# EAGLE design DMSMDS (EAGLE 8.0.1)
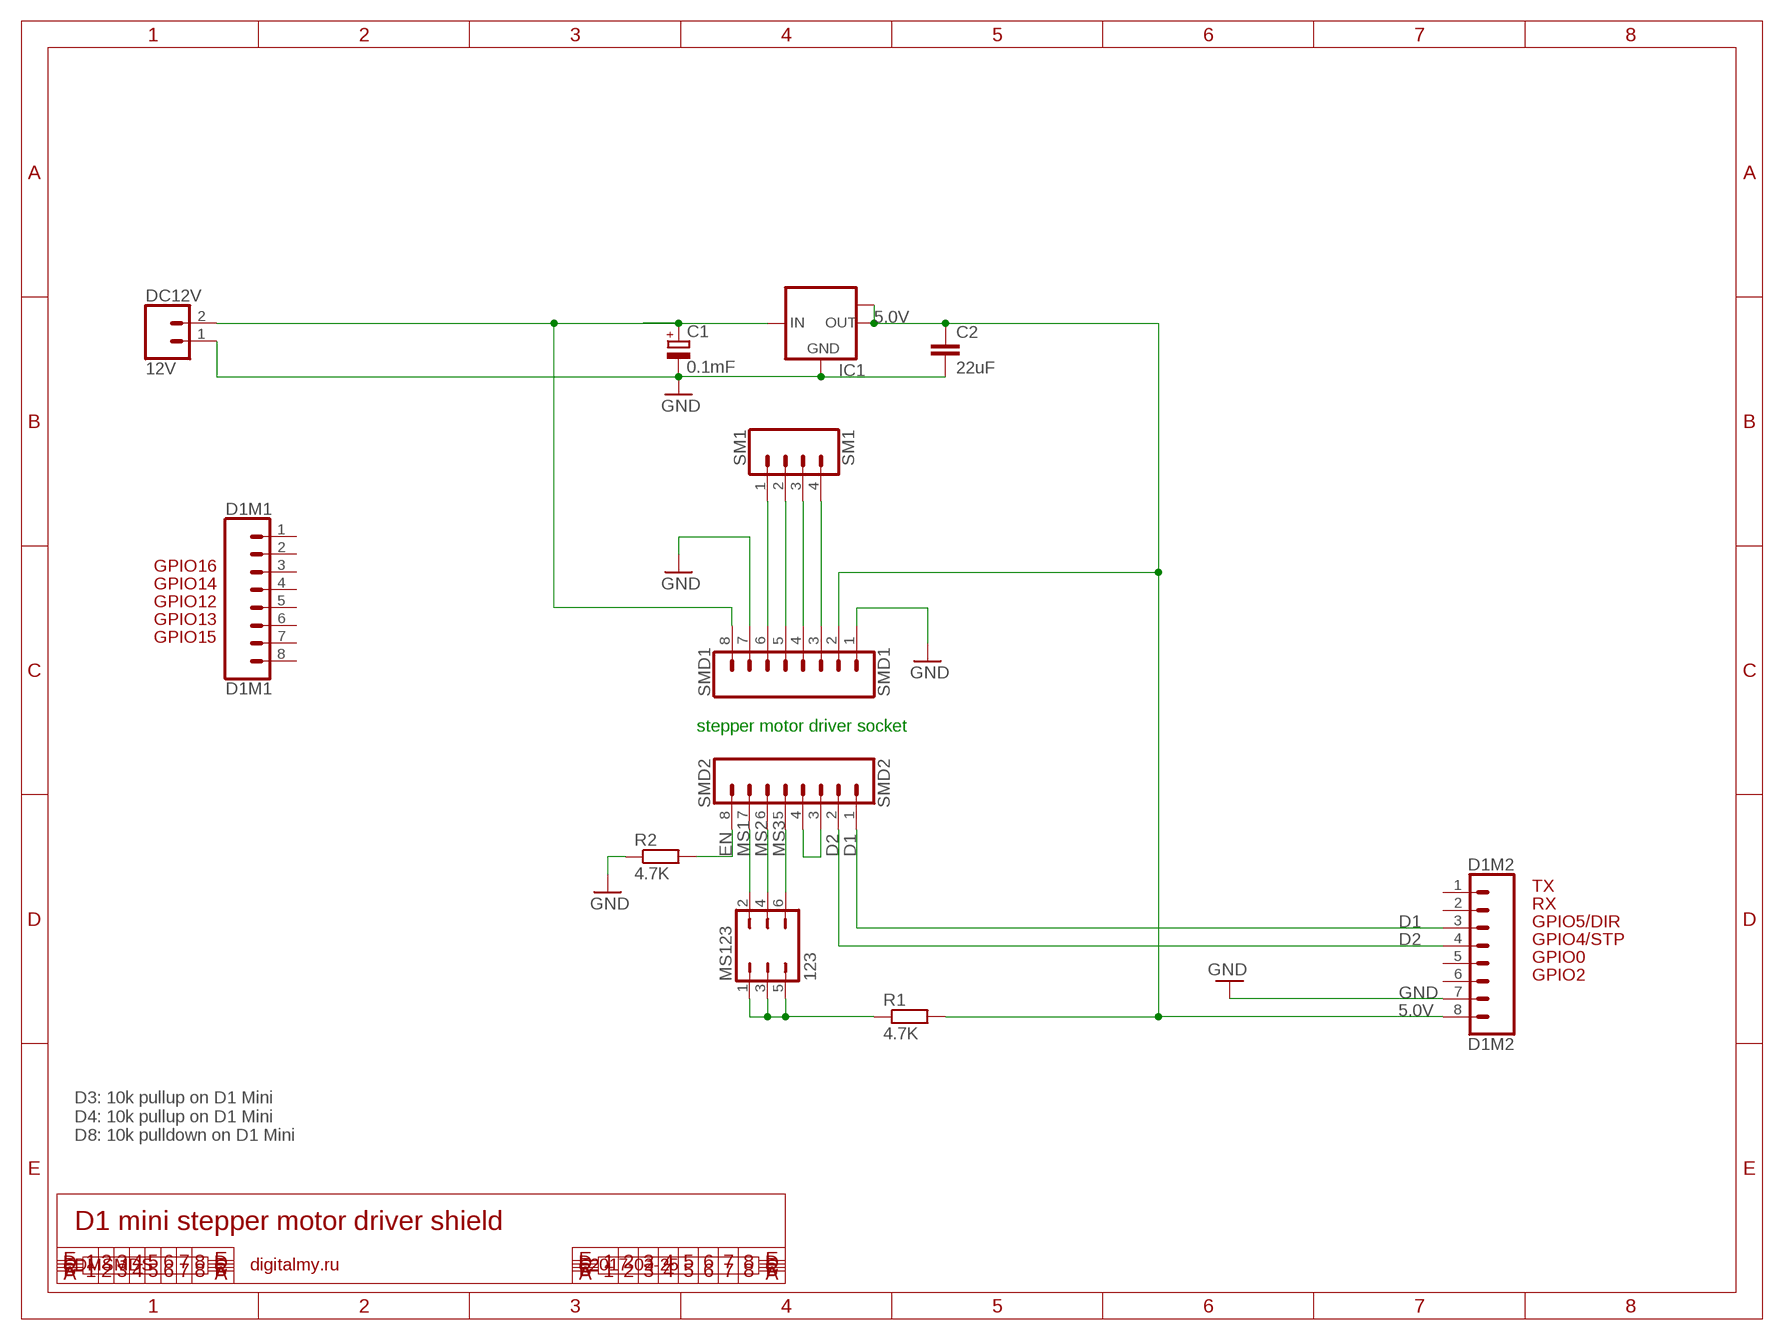
[diagram p0: schematic, sheet 1]

## Parts
C1  0.1mF  CPOL-EUE5-8.5  [E5-8,5]
C2  22uF  C-EUC1206  [C1206]
D1M1  D1M1  CONN_08"  [1X08]
D1M2  D1M2  CONN_08"  [1X08]
DC12V  12V  CONN_02  [1X02]
IC1  LM1117MPX-5.0  [SOT223]
MS123  123  JP3Q  [JP3Q]
R1  4.7K  R-EU_R0402  [R0402]
R2  4.7K  R-EU_R0402  [R0402]
SM1  SM1  CONN_04  [1X04]
SMD1  SMD1  CONN_08NO_SILK_FEMALE_PTH  [1X08_NO_SILK]
SMD2  SMD2  CONN_08NO_SILK_FEMALE_PTH  [1X08_NO_SILK]

## Nets
5.0V [power]: C2.1 D1M2.8 IC1.2(OUT) IC1.TAB(OUT1) R1.2 SMD1.2
12V: C1.+ DC12V.2 IC1.3(IN) SMD1.8
D1: D1M2.3 SMD2.1
D2: D1M2.4 SMD2.2
EN: R2.2 SMD2.8
GND [power]: C1.- C2.2 D1M2.7 DC12V.1 IC1.1(GND) R2.1 SMD1.1 SMD1.7
MS1: MS123.2 SMD2.7
MS2: MS123.4 SMD2.6
MS3: MS123.6 SMD2.5
MSP: MS123.1 MS123.3 MS123.5 R1.1
N$1: SM1.1 SMD1.6
N$2: SM1.2 SMD1.5
N$3: SM1.3 SMD1.4
N$4: SM1.4 SMD1.3
N$10: SMD2.3 SMD2.4
Unconnected: D1M1.1 D1M1.2 D1M1.3 D1M1.4 D1M1.5 D1M1.6 D1M1.7 D1M1.8 D1M2.1 D1M2.2 D1M2.5 D1M2.6

## Notes on the sheet
- GPIO16
- GPIO14
- GPIO12
- GPIO13
- GPIO15
- stepper motor driver socket
- TX
- RX
- GPIO5/DIR
- GPIO4/STP
- GPIO0
- GPIO2
- D3: 10k pullup on D1 Mini
  D4: 10k pullup on D1 Mini
  D8: 10k pulldown on D1 Mini
- D1 mini stepper motor driver shield
- DMSMDS | digitalmy.ru | 2017-02-25

## Library data of the parts
C1 = rcl:CPOL-EU: POLARIZED CAPACITOR, European symbol
C2 = resistor:C-EU: CAPACITOR, European symbol
D1M1 D1M2 SMD1 SMD2 = SparkFun-Connectors:CONN_08: Multi connection point. Often used as Generic Header-pin footprint for 0.1 inch spaced/style header connections On any of the 0.1 inch spaced packages, you can populate with these: Break Away Headers - Straight <https://www.sparkfun.com/products/116> (PRT-00116) Break Away Male Headers - Right Angle <https://www.sparkfun.com/products/553> (PRT-00553) Female Headers <https://www.sparkfun.com/products/115> (PRT-00115) Break Away Headers - Machine Pin <https://www.sparkfun.com/products/117> (PRT-00117) Break Away Female Headers - Swiss Machine Pin <https://www.sparkfun.com/products/743> (PRT-00743) Arduino Stackable Header - 8 Pin <https://www.sparkfun.com/products/9279> (PRT-09279) For SCREWTERMINALS and SPRING TERMINALS visit here: Screw Terimnals on SparkFun.com <https://www.sparkfun.com/search/results?term=Screw+Terminals> (5mm/3.5mm/2.54mm spacing) This device is also useful as a general connection point to wire up your design to another part of your project. Our various solder wires solder well into these plated through hole pads. Hook-Up Wire - Assortment (Stranded, 22 AWG) <https://www.sparkfun.com/products/11375> (PRT-11375) Hook-Up Wire - Assortment (Solid Core, 22 AWG) <https://www.sparkfun.com/products/11367> (PRT-11367) View the entire wire category on our website here <https://www.sparkfun.com/categories/141> Special notes: Molex polarized connector foot print use with SKU : PRT-08231 with associated crimp pins and housings. 1MM SMD Version SKU: PRT-10208 NOTES ON THE VARIANTS LOCK and LOCK_LONGPADS... This footprint was designed to help hold the alignment of a through-hole component (i.e. 6-pin header) while soldering it into place. You may notice that each hole has been shifted either up or down by 0.005 of an inch from it's more standard position (which is a perfectly straight line). This slight alteration caused the pins (the squares in the middle) to touch the edges of the holes. Because they are alternating, it causes a "brace" to hold the component in place. 0.005 has proven to be the perfect amount of "off-center" position when using our standard breakaway headers. Although looks a little odd when you look at the bare footprint, once you have a header in there, the alteration is very hard to notice. Also,if you push a header all the way into place, it is covered up entirely on the bottom side.; PROD_ID: CONN-08438
DC12V = SparkFun-Connectors:CONN_02: Multi connection point. Often used as Generic Header-pin footprint for 0.1 inch spaced/style header connections On any of the 0.1 inch spaced packages, you can populate with these: Break Away Headers - Straight <https://www.sparkfun.com/products/116> (PRT-00116) Break Away Male Headers - Right Angle <https://www.sparkfun.com/products/553> (PRT-00553) Female Headers <https://www.sparkfun.com/products/115> (PRT-00115) Break Away Headers - Machine Pin <https://www.sparkfun.com/products/117> (PRT-00117) Break Away Female Headers - Swiss Machine Pin <https://www.sparkfun.com/products/743> (PRT-00743) For SCREWTERMINALS and SPRING TERMINALS visit here: Screw Terimnals on SparkFun.com <https://www.sparkfun.com/search/results?term=Screw+Terminals> (5mm/3.5mm/2.54mm spacing) This device is also useful as a general connection point to wire up your design to another part of your project. Our various solder wires solder well into these plated through hole pads. Hook-Up Wire - Assortment (Stranded, 22 AWG) <https://www.sparkfun.com/products/11375> (PRT-11375) Hook-Up Wire - Assortment (Solid Core, 22 AWG) <https://www.sparkfun.com/products/11367> (PRT-11367) View the entire wire category on our website here <https://www.sparkfun.com/categories/141> Special notes: Molex polarized connector foot print use with: PRT-08233 with associated crimp pins and housings. 2.54_SCREWTERM for use with PRT-10571. 3.5mm Screw Terminal footprints for PRT-08084 5mm Screw Terminal footprints for use with PRT-08432
IC1 = lm1117:LM1117MPX-*
MS123 = jumper:JP3Q: JUMPER
R1 R2 = resistor:R-EU_: RESISTOR, European symbol
SM1 = SparkFun-Connectors:CONN_04: Multi connection point. Often used as Generic Header-pin footprint for 0.1 inch spaced/style header connections On any of the 0.1 inch spaced packages, you can populate with these: Break Away Headers - Straight <https://www.sparkfun.com/products/116> (PRT-00116) Break Away Male Headers - Right Angle <https://www.sparkfun.com/products/553> (PRT-00553) Female Headers <https://www.sparkfun.com/products/115> (PRT-00115) Break Away Headers - Machine Pin <https://www.sparkfun.com/products/117> (PRT-00117) Break Away Female Headers - Swiss Machine Pin <https://www.sparkfun.com/products/743> (PRT-00743) For SCREWTERMINALS and SPRING TERMINALS visit here: Screw Terimnals on SparkFun.com <https://www.sparkfun.com/search/results?term=Screw+Terminals> (5mm/3.5mm/2.54mm spacing) This device is also useful as a general connection point to wire up your design to another part of your project. Our various solder wires solder well into these plated through hole pads. Hook-Up Wire - Assortment (Stranded, 22 AWG) <https://www.sparkfun.com/products/11375> (PRT-11375) Hook-Up Wire - Assortment (Solid Core, 22 AWG) <https://www.sparkfun.com/products/11367> (PRT-11367) View the entire wire category on our website here <https://www.sparkfun.com/categories/141> Special notes: Molex polarized connector foot print use with SKU : PRT-08231 with associated crimp pins and housings. 1MM SMD Version SKU: PRT-10208; PROD_ID: CONN-09696

## Net classes
0 default: width 0.203 mm, drill 0.356 mm, clearance 0.152 mm
1 power: width 0.203 mm, clearance 0.152 mm

## Board
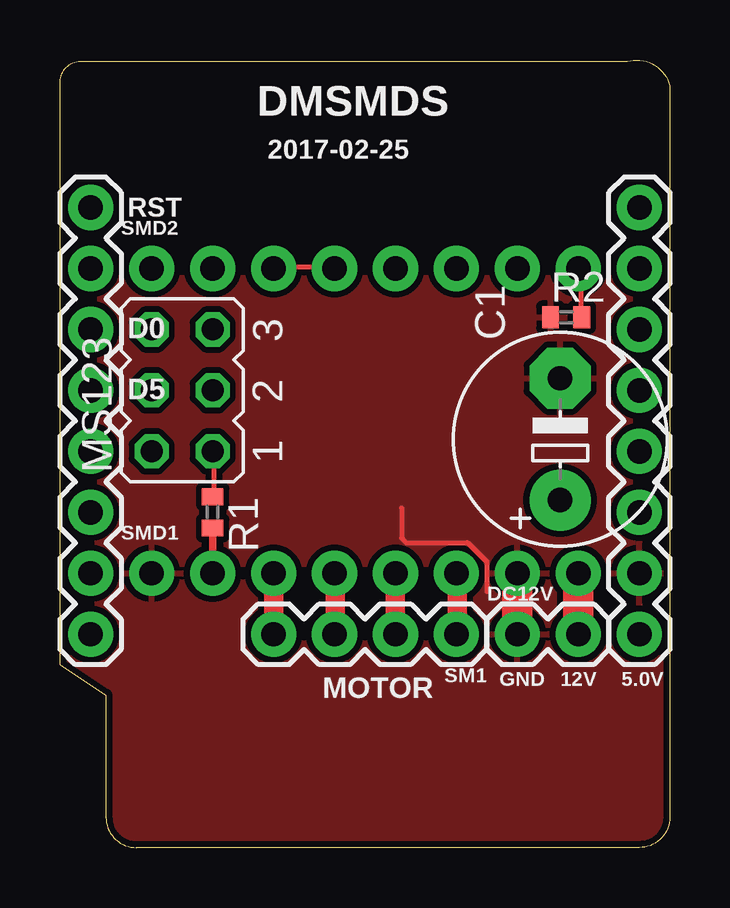
[diagram p1: board, top side]
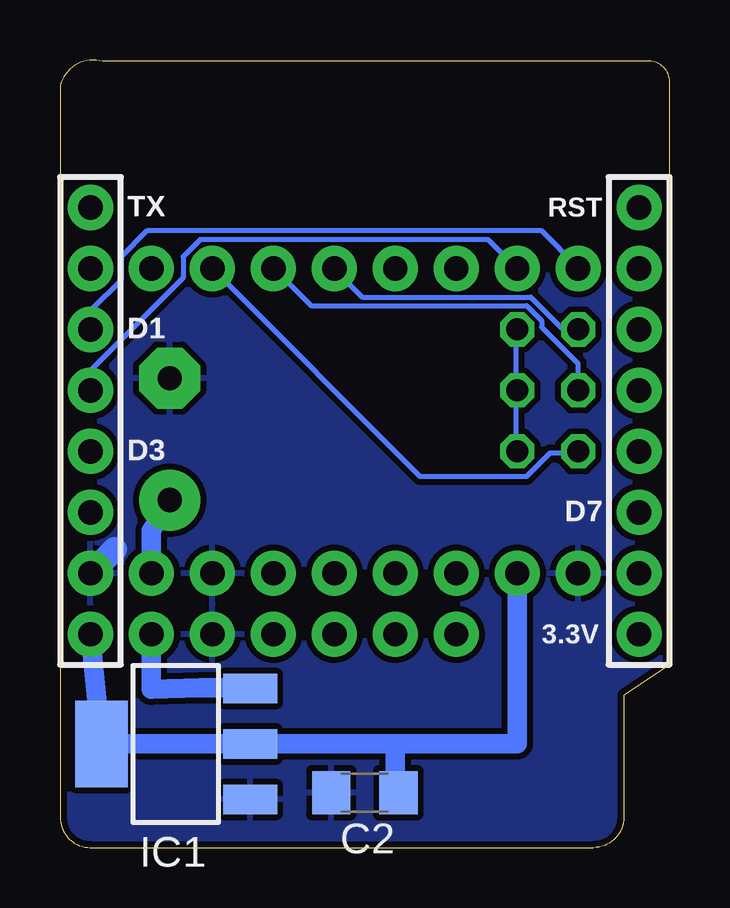
[diagram p2: board, bottom side, seen from below]

Size 25.41 x 32.82 mm. Coordinates in mm from the lower left corner, seen from the top.
Outline: 25.41,31.75 25.41,1.27 arc-90 24.14,0 3.18,0 arc-90 1.91,1.27 1.91,6.35 0.01,7.62 0.01,31.75 arc-90 0.77,32.77 23.63,32.77 arc-90 25.41,31.75
Copper layers (1*16): Top 0.035mm / dielectric 1.5mm / Bottom 0.035mm
Design rules "ElectroDragon_2layer_DRU_no_angle_20140221": minimum track width 6mil, minimum drill 12mil, track to track 6mil, track to pad 6mil, pad to pad 6mil, via to via 6mil, smd to smd 6mil, copper to edge 8mil, drill to drill 6mil, minimum pad ring 10mil, minimum via ring 6mil, stop-mask expansion 4mil, vias tented up to drill 100mil, thermal gap 10mil

### Footprints (pad centres in the part's own frame; a part is rotated, then mirrored left to right if it is on the bottom)
E5-8,5 = drill 1.016 pad 2.54: + -2.54,0 | drill 1.016 pad 2.54 octagon: - 2.54,0
C1206 = smd 1.6 x 1.8: 1 -1.4,0; 2 1.4,0
1X08 = drill 1.016 pad 1.88: 1 0,0; 2 2.54,0; 3 5.08,0; 4 7.62,0; 5 10.16,0; 6 12.7,0; 7 15.24,0; 8 17.78,0
1X02 = drill 1.016 pad 1.88: 1 0,0; 2 2.54,0
SOT223 = smd 1.219 x 2.235: 1 -2.311,-3.099; 2 0,-3.099; 3 2.311,-3.099 | smd 3.6 x 2.2: TAB 0,3.099
JP3Q = drill 0.914 octagon: 1 -2.54,-1.27; 2 -2.54,1.27; 3 0,-1.27; 4 0,1.27; 5 2.54,-1.27; 6 2.54,1.27
R0402 = smd 0.7 x 0.9: 1 -0.65,0; 2 0.65,0
1X04 = drill 1.016 pad 1.88: 1 0,0; 2 2.54,0; 3 5.08,0; 4 7.62,0
1X08_NO_SILK = drill 1.016 pad 1.88: 1 0,0; 2 2.54,0; 3 5.08,0; 4 7.62,0; 5 10.16,0; 6 12.7,0; 7 15.24,0; 8 17.78,0

### Placement (x,y rotation side)
C1  20.84,17.02 90 top
C2  12.71,2.29 180 bottom
D1M1  1.28,26.67 270 top
D1M2  24.14,26.67 270 top
DC12V  19.06,8.89 0 top
IC1  20.58,4.32 90 bottom
MS123  5.09,19.05 90 top
R1  6.36,13.97 270 top
R2  21.09,22.1 0 top
SM1  16.52,8.89 180 top
SMD1  3.82,11.43 0 top
SMD2  3.82,24.13 0 top

### Tracks (layer width: path | path; a pad name or v marks a point on that pad's centre or on a via)
5.0V
  Top 0.203: 6.41,11.47 SMD1.2
  Top 0.305: SMD1.2 R1.2 6.36,13.46
  Bottom 0.203: 6.41,11.38 SMD1.2 | 16.9,4.53 IC1.2
  Bottom 0.813: D1M2.8 IC1.TAB IC1.2 11.44,4.32 | SMD1.2 6.36,4.32 11.44,4.32 | C2.1 arc90 11.44,2.42 11.44,4.32
12V
  Top 1.27: DC12V.2 SMD1.8
  Bottom 0.203: 17.52,6.67 IC1.3 17.43,6.67 | DC12V.2 21.78,8.89
  Bottom 0.813: 17.52,6.67 19.55,6.67 21.6,6.6 DC12V.2 | C1.+ 21.6,13.21 SMD1.8
D1
  Bottom 0.203: D1M2.3 24.1,21.6 24.1,22.4 22.86,23.65 22.86,24.62 21.79,25.69 5.34,25.69 3.83,24.18 SMD2.1
D2
  Bottom 0.203: SMD2.2 7.56,25.34 19.57,25.34 20.28,24.62 20.28,23.74 24.1,19.91 24.1,19.11 D1M2.4
EN
  Top 0.203: R2.2 21.7,22.14 21.7,24 21.61,24.09 SMD2.8
GND
  Top 0.203: 17.79,10.67 17.79,11.91 16.99,12.71 14.41,12.71 14.23,12.89 14.23,14.15 | 18.94,9.07 DC12V.1
  Top 1.27: DC12V.1 SMD1.7
  Bottom 0: D1M2.7 24.12,11.43 | 23.12,12.43 23.12,12.7
  Bottom 1.016: 24.12,11.43 23.12,12.43
  pour Top (isolate 0.254): 25.41,1.27 25.41,31.03 arc90 23.67,32.77 0.77,32.77 arc90 0.01,31.75 0.01,7.62 1.91,6.35 1.91,1.27 arc90 3.18,0 24.14,0 arc90
  pour Bottom (isolate 0.254): 25.41,1.27 25.41,31.24 arc90 23.63,32.77 0.77,32.77 arc90 0.01,31.75 0.01,7.62 1.91,6.35 1.91,1.27 arc90 3.18,0 24.14,0 arc90
MS1
  Bottom 0.203: MS123.2 3.83,16.45 4.99,16.45 5.96,15.47 10.41,15.47 19.03,24.09 SMD2.7
MS2
  Bottom 0.203: MS123.4 3.83,19.11 3.83,20.18 5.34,21.69 5.34,21.96 5.96,22.58 14.94,22.58 16.46,24.09 SMD2.6
MS3
  Bottom 0.203: MS123.6 3.83,21.6 4.45,21.6 5.79,22.94 12.81,22.94 13.97,24.09 SMD2.5
MSP
  Top 0.203: R1.1 6.41,14.67 6.41,16.45 MS123.1
  Bottom 0.203: MS123.5 6.41,21.51 6.41,19.11 MS123.3 6.41,19.02 6.41,16.54 MS123.1
N$1
  Top 0.203: 16.54,8.89 SM1.1 | 16.54,11.38 SMD1.6
  Top 0.813: 16.54,11.38 16.54,8.89
N$2
  Top 0.203: 13.97,8.89 SM1.2 | 13.97,11.38 SMD1.5
  Top 0.813: 13.97,11.38 13.97,8.89
N$3
  Top 0.203: 11.48,8.89 SM1.3 | 11.48,11.38 SMD1.4
  Top 0.813: 11.48,11.38 11.48,8.89
N$4
  Top 0.813: SMD1.3 SM1.4
N$10
  Top 0.203: SMD2.3 8.9,24.18 11.39,24.18 SMD2.4

### Text on the board
tPlace: DMSMDS | 2017-02-25 | RST | D0 | D5 | GND | 12V | 5.0V | MOTOR
bPlace: RST | TX | D1 | D3 | D7 | 3.3V